# EAGLE design robot secondaire (EAGLE 6.3)
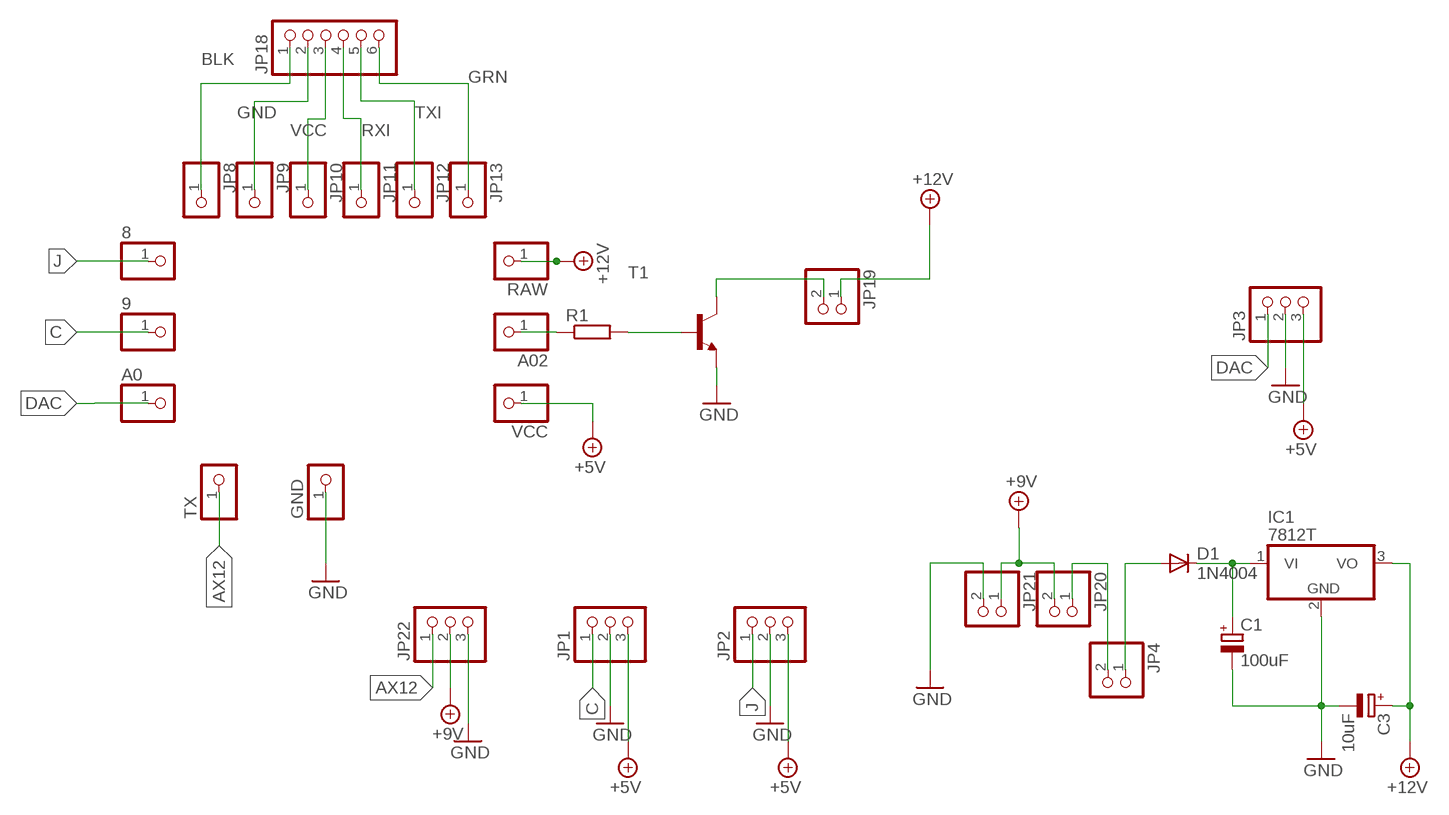
[diagram p0: schematic, sheet 1]

## Parts
8  PINHD-1X1  [1X01]
9  PINHD-1X1  [1X01]
A0  PINHD-1X1  [1X01]
A02  PINHD-1X1  [1X01]
C1  100uF  CPOL-EUE3.5-10  [E3,5-10]
C3  10uF  CPOL-EUE2,5-6E  [E2,5-6E]
D1  1N4004  [DO41-10]
GND  PINHD-1X1  [1X01]
IC1  7812T  [TO220H]
JP1  PINHD-1X3  [1X03]
JP2  PINHD-1X3  [1X03]
JP3  PINHD-1X3  [1X03]
JP4  PINHD-1X2  [1X02]
JP8  PINHD-1X1  [1X01]
JP9  PINHD-1X1  [1X01]
JP10  PINHD-1X1  [1X01]
JP11  PINHD-1X1  [1X01]
JP12  PINHD-1X1  [1X01]
JP13  PINHD-1X1  [1X01]
JP18  PINHD-1X6  [1X06]
JP19  PINHD-1X2  [1X02]
JP20  PINHD-1X2  [1X02]
JP21  PINHD-1X2  [1X02]
JP22  PINHD-1X3  [1X03]
R1  R-EU_0204/7  [0204/7]
RAW  PINHD-1X1  [1X01]
T1  2N4124-NPN-TO92-CBE  [TO92-CBE]
TX  PINHD-1X1  [1X01]
VCC  PINHD-1X1  [1X01]

## Nets
+5V: JP1.3 JP2.3 JP3.3 VCC.1
+9V: JP20.2 JP21.1 JP22.2
+12V: C3.+ IC1.3(VO) JP19.1 RAW.1
AX12: JP22.1 TX.1
BLK: JP8.1 JP18.1
C: 9.1 JP1.1
CMD_MOTEUR: A02.1 R1.1
DAC: A0.1 JP3.1
GND: C1.- C3.- GND.1 IC1.2(GND) JP1.2 JP2.2 JP3.2 JP9.1 JP18.2 JP21.2 JP22.3 T1.E
GRN: JP13.1 JP18.6
J: 8.1 JP2.1
N$1: C1.+ D1.C IC1.1(VI)
N$3: D1.A JP4.1
N$4: JP4.2 JP20.1
N$6: R1.2 T1.B
N$7: JP19.2 T1.C
RXI: JP11.1 JP18.4
TXI: JP12.1 JP18.5
VCC: JP10.1 JP18.3

## Library data of the parts
8 9 A0 A02 GND JP8-JP13 RAW TX VCC = pinhead:PINHD-1X1: PIN HEADER
C1 C3 = rcl:CPOL-EU: POLARIZED CAPACITOR, European symbol
D1 = diode:1N4004: DIODE general purpose rectifier, 1 A
IC1 = linear:78*: Positive VOLTAGE REGULATOR Source: http://cache.national.com/ds/LM/LM78L05.pdf http://www.fairchildsemi.com/ds/LM/LM7805.pdf
JP1-JP3 JP22 = pinhead:PINHD-1X3: PIN HEADER
JP4 JP19-JP21 = pinhead:PINHD-1X2: PIN HEADER
JP18 = pinhead:PINHD-1X6: PIN HEADER
R1 = rcl:R-EU_: RESISTOR, European symbol
T1 = transistor:*-NPN-: NPN Transistror BF959 corrected 2008.03.06

## Board
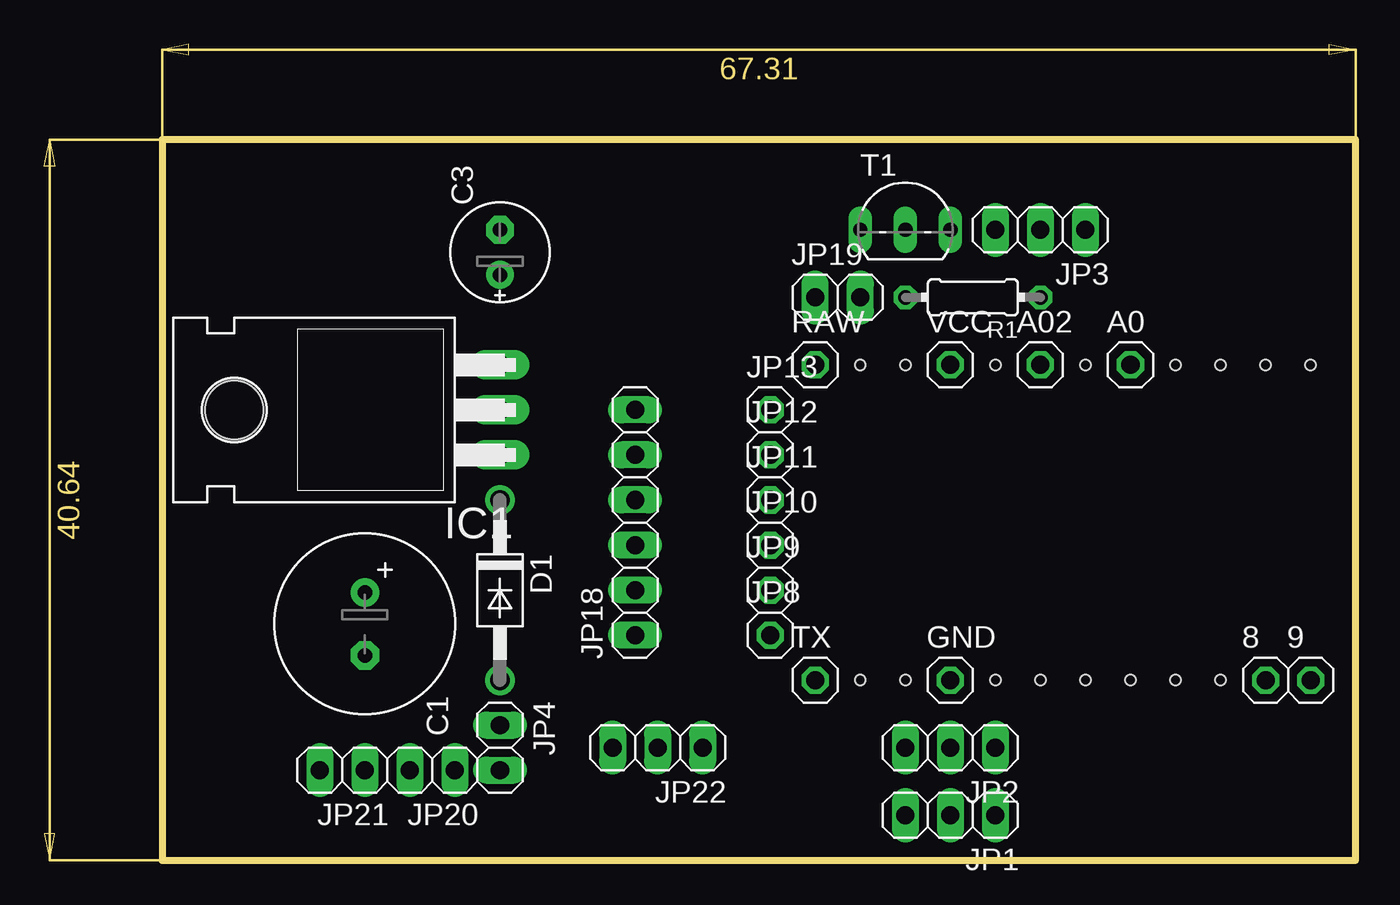
[diagram p1: board, top side]
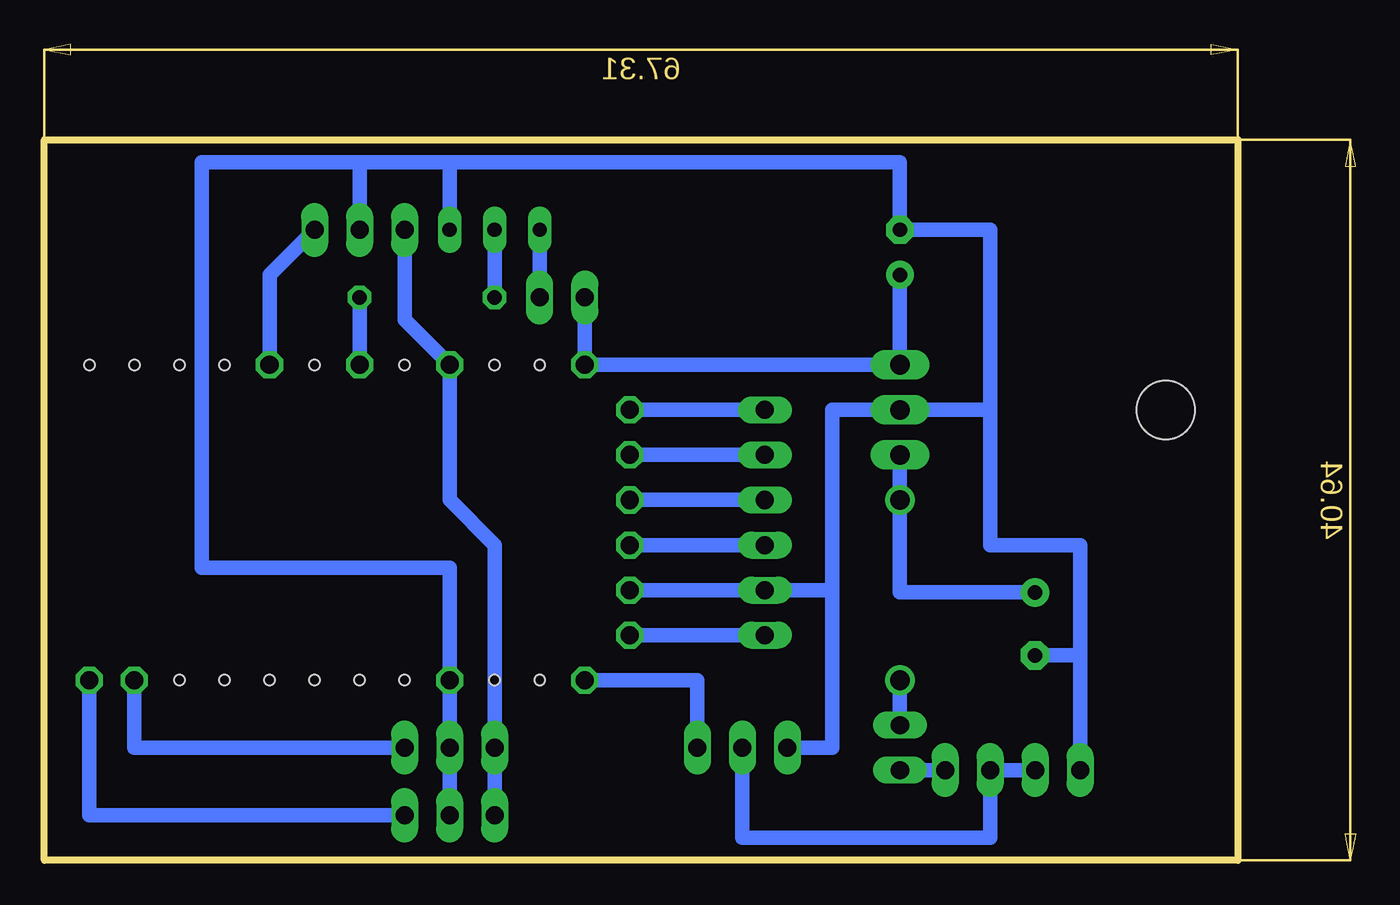
[diagram p2: board, bottom side, seen from below]

Size 67.31 x 40.64 mm. Coordinates in mm from the lower left corner, seen from the top.
Outline: 67.31,40.64 0,40.64 0,0 67.31,0 67.31,40.64
Copper layers (1*16): Top 0.035mm / dielectric 1.5mm / Bottom 0.035mm
Design rules "default *": minimum track width 10mil, minimum drill 24mil, track to track 32mil, track to pad 32mil, pad to pad 32mil, via to via 32mil, smd to smd 32mil, copper to edge 40mil, drill to drill 8mil, minimum pad ring 10mil, minimum via ring 8mil, stop-mask expansion 4mil, vias tented up to drill 0mil, thermal gap 10mil
Holes 0.6 mm at 41.91,27.94 39.37,27.94 52.07,27.94 57.15,27.94 59.69,27.94 62.23,27.94 39.37,10.16 41.91,10.16 52.07,10.16 54.61,10.16 57.15,10.16 59.69,10.16 46.99,27.94 49.53,10.16 46.99,10.16 64.77,27.94

### Footprints (pad centres in the part's own frame; a part is rotated, then mirrored left to right if it is on the bottom)
1X01 = drill 1.016 octagon: 1 0,0
E3,5-10 = drill 0.813 pad 1.6: + -1.778,0 | drill 0.813 pad 1.6 octagon: - 1.778,0
E2,5-6E = drill 0.813 pad 1.575: + -1.27,0 | drill 0.813 pad 1.575 octagon: - 1.27,0
DO41-10 = drill 1.118: A 5.08,0; C -5.08,0
TO220H = drill 1.118 long: 1 -2.54,-10.16; 2 0,-10.16; 3 2.54,-10.16 | hole 3.302: 0,4.826
1X03 = drill 1.016 long: 1 -2.54,0; 2 0,0; 3 2.54,0
1X02 = drill 1.016 long: 1 -1.27,0; 2 1.27,0
1X06 = drill 1.016 long: 1 -6.35,0; 2 -3.81,0; 3 -1.27,0; 4 1.27,0; 5 3.81,0; 6 6.35,0
0204/7 = drill 0.813 octagon: 1 -3.81,0; 2 3.81,0
TO92-CBE = drill 0.813 long: B 0,0; C -2.54,0; E 2.54,0

### Placement (x,y rotation side)
8  62.23,10.16 0 top
9  64.77,10.16 0 top
A0  54.61,27.94 0 top
A02  49.53,27.94 0 top
C1  11.43,13.34 270 top
C3  19.05,34.29 90 top
D1  19.05,15.24 270 top
GND  44.45,10.16 0 top
IC1  8.89,25.4 90 top
JP1  44.45,2.54 180 top
JP2  44.45,6.35 180 top
JP3  49.53,35.56 180 top
JP4  19.05,6.35 270 top
JP8  34.29,12.7 0 top
JP9  34.29,15.24 0 top
JP10  34.29,17.78 0 top
JP11  34.29,20.32 0 top
JP12  34.29,22.86 0 top
JP13  34.29,25.4 0 top
JP18  26.67,19.05 90 top
JP19  38.1,31.75 0 top
JP20  15.24,5.08 180 top
JP21  10.16,5.08 180 top
JP22  27.94,6.35 180 top
R1  45.72,31.75 180 top
RAW  36.83,27.94 0 top
T1  41.91,35.56 0 top
TX  36.83,10.16 0 top
VCC  44.45,27.94 0 top

### Tracks (layer width: path | path; a pad name or v marks a point on that pad's centre or on a via)
+5V
  Bottom 0.813: JP3.3 46.99,30.48 VCC.1 44.45,20.32 41.91,17.78 JP2.3 JP1.3
+9V
  Bottom 0.813: JP21.1 JP20.2 13.97,1.27 27.94,1.27 JP22.2
+12V
  Bottom 0.813: JP19.1 RAW.1 IC1.3 C3.+
AX12
  Bottom 0.813: JP22.1 30.48,10.16 TX.1
BLK
  Bottom 0.813: JP18.1 JP8.1
C
  Bottom 0.813: JP1.1 64.77,2.54 9.1
CMD_MOTEUR
  Bottom 0.813: R1.1 A02.1
DAC
  Bottom 0.813: A0.1 54.61,33.02 JP3.1
GND
  Bottom 0.813: T1.E 44.45,39.37 | 44.45,39.37 49.53,39.37 | 49.53,39.37 JP3.2 | 13.97,25.4 IC1.2 22.86,25.4 22.86,15.24 | 13.97,25.4 13.97,17.78 8.89,17.78 8.89,11.56 | 22.86,15.24 JP18.2 JP9.1 | JP1.2 JP2.2 GND.1 44.45,16.51 58.42,16.51 58.42,39.37 49.53,39.37 | JP22.3 22.86,6.35 22.86,15.24 | 44.45,39.37 19.05,39.37 C3.- 13.97,35.56 13.97,25.4 | JP21.2 8.89,11.56 | 8.89,11.56 C1.-
GRN
  Bottom 0.813: JP18.6 JP13.1
J
  Bottom 0.813: JP2.1 62.23,6.35 8.1
N$1
  Bottom 0.813: IC1.1 D1.C 19.05,15.11 C1.+
N$3
  Bottom 0.813: D1.A JP4.1
N$4
  Bottom 0.813: JP20.1 JP4.2
N$6
  Bottom 0.813: T1.B R1.2
N$7
  Bottom 0.813: JP19.2 T1.C
RXI
  Bottom 0.813: JP18.4 JP11.1
TXI
  Bottom 0.813: JP18.5 JP12.1
VCC
  Bottom 0.813: JP18.3 JP10.1